# EAGLE design blink1disc_v2a (EAGLE 6.6.0)
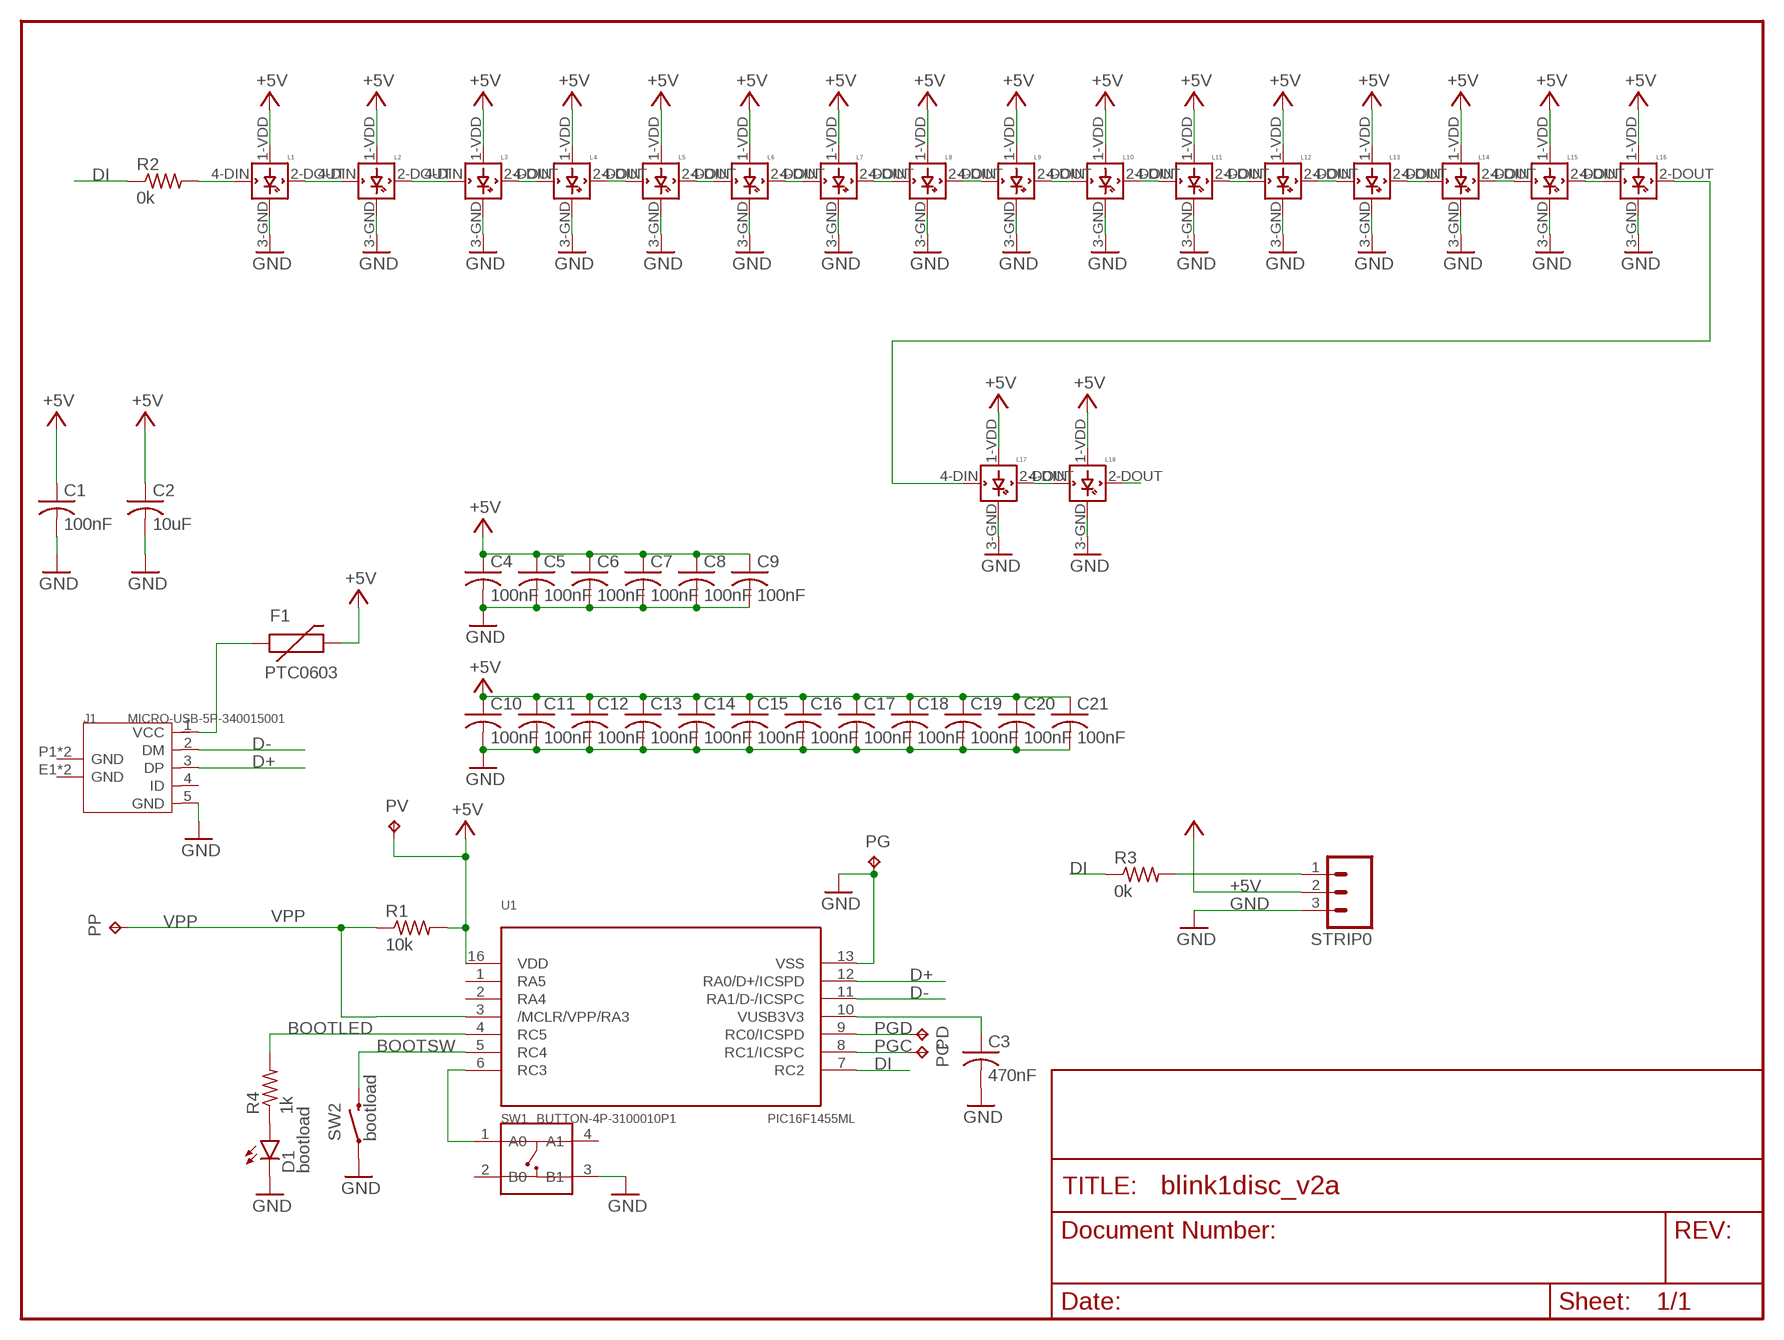
[diagram p0: schematic, sheet 1]

## Parts
C1  100nF  C-USC0603  [C0603]
C2  10uF  C-USC0603  [C0603]
C3  470nF  C-USC0603  [C0603]
C4  100nF  C-USC0603  [C0603]
C5  100nF  C-USC0603  [C0603]
C6  100nF  C-USC0603  [C0603]
C7  100nF  C-USC0603  [C0603]
C8  100nF  C-USC0603  [C0603]
C9  100nF  C-USC0603  [C0603]
C10  100nF  C-USC0603  [C0603]
C11  100nF  C-USC0603  [C0603]
C12  100nF  C-USC0603  [C0603]
C13  100nF  C-USC0603  [C0603]
C14  100nF  C-USC0603  [C0603]
C15  100nF  C-USC0603  [C0603]
C16  100nF  C-USC0603  [C0603]
C17  100nF  C-USC0603  [C0603]
C18  100nF  C-USC0603  [C0603]
C19  100nF  C-USC0603  [C0603]
C20  100nF  C-USC0603  [C0603]
C21  100nF  C-USC0603  [C0603]
D1  bootload  LED-RED0603  [LED-0603]
F1  PTC0603  [0603]
J1  MICRO-USB-5P-340015001  [B-SMD-5P]
L1  WS2812B  [WS2812B]
L2  WS2812B  [WS2812B]
L3  WS2812B  [WS2812B]
L4  WS2812B  [WS2812B]
L5  WS2812B  [WS2812B]
L6  WS2812B  [WS2812B]
L7  WS2812B  [WS2812B]
L8  WS2812B  [WS2812B]
L9  WS2812B  [WS2812B]
L10  WS2812B  [WS2812B]
L11  WS2812B  [WS2812B]
L12  WS2812B  [WS2812B]
L13  WS2812B  [WS2812B]
L14  WS2812B  [WS2812B]
L15  WS2812B  [WS2812B]
L16  WS2812B  [WS2812B]
L17  WS2812B  [WS2812B]
L18  WS2812B  [WS2812B]
PC  TPTP11SQ  [TP11SQ]
PD  TPTP11SQ  [TP11SQ]
PG  TPTP11SQ  [TP11SQ]
PP  TPTP11SQ  [TP11SQ]
PV  TPTP11SQ  [TP11SQ]
R1  10k  R-US_R0603  [R0603]
R2  0k  R-US_R0603  [R0603]
R3  0k  R-US_R0603  [R0603]
R4  1k  R-US_R0603  [R0603]
STRIP0  M03PTH  [1X03]
SW1  BUTTON-4P-3100010P1  [4P-SMD-6.0X6.0X5.0H]
SW2  bootload  SWITCH-MOMENTARY-2TACTILE-SWITCH-SMD-RIGHT-ANGLE  [TACTILE_SWITCH-SMD-RIGHT-ANGLE]
U1  PIC16F1455ML  [QFN16_4X4]

## Nets
+5V: C1.1 C2.1 C4.1 C5.1 C6.1 C7.1 C8.1 C9.1 C10.1 C11.1 C12.1 C13.1 C14.1 C15.1 C16.1 C17.1 C18.1 C19.1 C20.1 C21.1 F1.2 L1.1-VDD(VDD) L2.1-VDD(VDD) L3.1-VDD(VDD) L4.1-VDD(VDD) L5.1-VDD(VDD) L6.1-VDD(VDD) L7.1-VDD(VDD) L8.1-VDD(VDD) L9.1-VDD(VDD) L10.1-VDD(VDD) L11.1-VDD(VDD) L12.1-VDD(VDD) L13.1-VDD(VDD) L14.1-VDD(VDD) L15.1-VDD(VDD) L16.1-VDD(VDD) L17.1-VDD(VDD) L18.1-VDD(VDD) PV.TP R1.2 STRIP0.2 U1.16(VDD)
BOOTLED: R4.2 U1.4(RC5)
BOOTSW: SW2.2 U1.5(RC4)
D+: J1.3(DP) U1.12(RA0/D+/ICSPD)
D-: J1.2(DM) U1.11(RA1/D-/ICSPC)
DI: R2.1 R3.1 U1.7(RC2)
DO1: L2.2-DOUT(DOUT) L3.4-DIN(DIN)
GND: C1.2 C2.2 C3.2 C4.2 C5.2 C6.2 C7.2 C8.2 C9.2 C10.2 C11.2 C12.2 C13.2 C14.2 C15.2 C16.2 C17.2 C18.2 C19.2 C20.2 C21.2 D1.C J1.5(GND) L1.3-GND(GND) L2.3-GND(GND) L3.3-GND(GND) L4.3-GND(GND) L5.3-GND(GND) L6.3-GND(GND) L7.3-GND(GND) L8.3-GND(GND) L9.3-GND(GND) L10.3-GND(GND) L11.3-GND(GND) L12.3-GND(GND) L13.3-GND(GND) L14.3-GND(GND) L15.3-GND(GND) L16.3-GND(GND) L17.3-GND(GND) L18.3-GND(GND) PG.TP STRIP0.3 SW1.3(B1) SW2.1 U1.13(VSS)
N$1: L3.2-DOUT(DOUT) L4.4-DIN(DIN)
N$2: L1.2-DOUT(DOUT) L2.4-DIN(DIN)
N$3: L5.2-DOUT(DOUT) L6.4-DIN(DIN)
N$4: L4.2-DOUT(DOUT) L5.4-DIN(DIN)
N$5: L7.2-DOUT(DOUT) L8.4-DIN(DIN)
N$6: L9.2-DOUT(DOUT) L10.4-DIN(DIN)
N$7: L8.2-DOUT(DOUT) L9.4-DIN(DIN)
N$8: L11.2-DOUT(DOUT) L12.4-DIN(DIN)
N$9: L13.2-DOUT(DOUT) L14.4-DIN(DIN)
N$10: L12.2-DOUT(DOUT) L13.4-DIN(DIN)
N$11: L1.4-DIN(DIN) R2.2
N$12: R3.2 STRIP0.1
N$13: L16.2-DOUT(DOUT) L17.4-DIN(DIN)
N$14: L15.2-DOUT(DOUT) L16.4-DIN(DIN)
N$15: L14.2-DOUT(DOUT) L15.4-DIN(DIN)
N$16: SW1.1(A0) U1.6(RC3)
N$17: L6.2-DOUT(DOUT) L7.4-DIN(DIN)
N$18: L17.2-DOUT(DOUT) L18.4-DIN(DIN)
N$21: D1.A R4.1
N$23: L18.2-DOUT(DOUT)
N$29: L10.2-DOUT(DOUT) L11.4-DIN(DIN)
PGC: PC.TP U1.8(RC1/ICSPC)
PGD: PD.TP U1.9(RC0/ICSPD)
VPP: PP.TP R1.1 U1.3(/MCLR/VPP/RA3)
VUSB: F1.1 J1.1(VCC)
VUSB3V3: C3.1 U1.10(VUSB3V3)
Unconnected: J1.4(ID) J1.E1(GND) J1.E2(GND) J1.P1(GND) J1.P2(GND) SW1.2(B0) SW1.4(A1) U1.1(RA5) U1.2(RA4)

## Library data of the parts
C1-C21 = rcl:C-US: CAPACITOR, American symbol
D1 = SparkFun-LED:LED-RED: Assorted Red LEDs LilyPad 1206- DIO-09912 1206- DIO-00809 0603- DIO-00819; PROD_ID: DIO-00819; VALUE: RED
F1 = SparkFun-PowerIC:PTC: Resettable Fuse PTC Resettable Fuse. Spark Fun Electronics SKU : COM-08357
J1 = OPL Eagle Library:MICRO-USB-5P: ST-USB-001E：MICRO USB B SMD R/A
L1-L18 = adafruit:WS2812B
PC PD PG PP PV = testpad:TP: Test pad
R1-R4 = rcl:R-US_: RESISTOR, American symbol
STRIP0 = SparkFun-Connectors:M03: Header 3 Standard 3-pin 0.1" header. Use with straight break away headers (SKU : PRT-00116), right angle break away headers (PRT-00553), swiss pins (PRT-00743), machine pins (PRT-00117), and female headers (PRT-00115). Molex polarized connector foot print use with SKU : PRT-08232 with associated crimp pins and housings.
SW1 = OPL Eagle Library:BUTTON-4P
SW2 = SparkFun-Electromechanical:SWITCH-MOMENTARY-2: Various NO switches- pushbuttons, reed, etc; PROD_ID: COMP-12265
U1 = todstuffnew:PIC16F1455

## Board
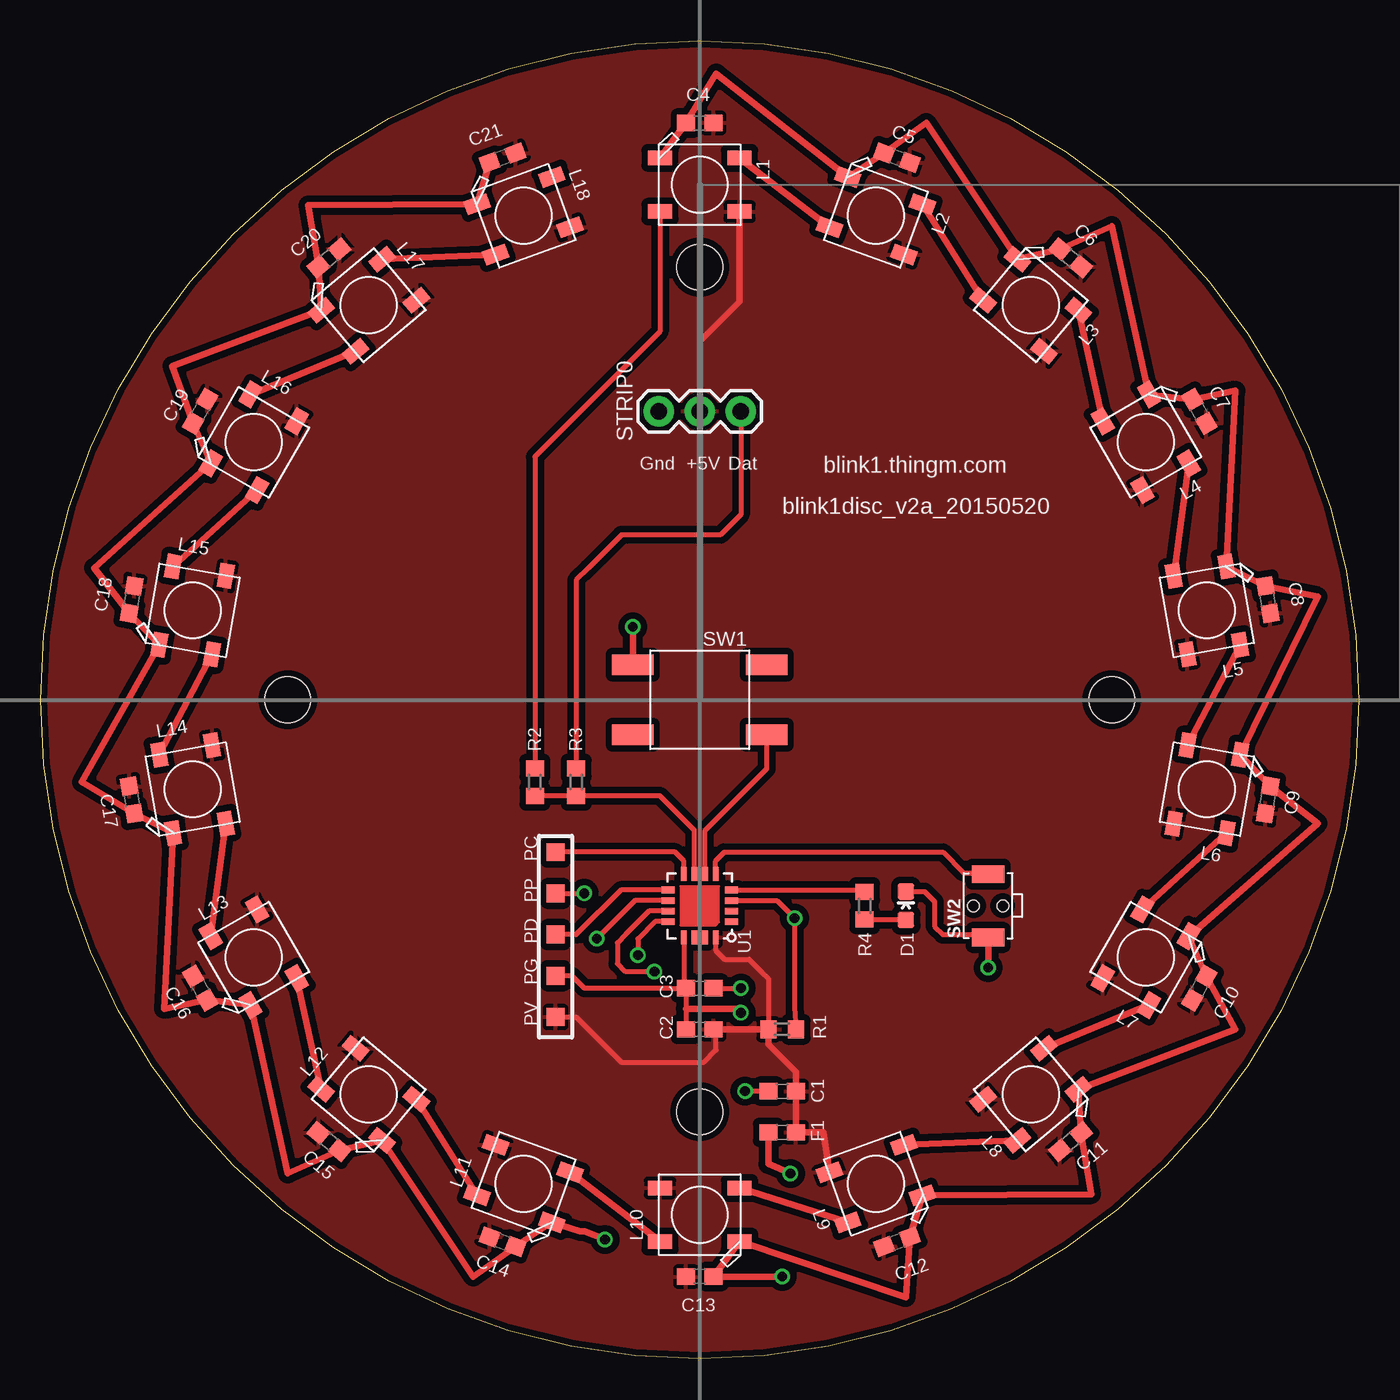
[diagram p1: board, top side]
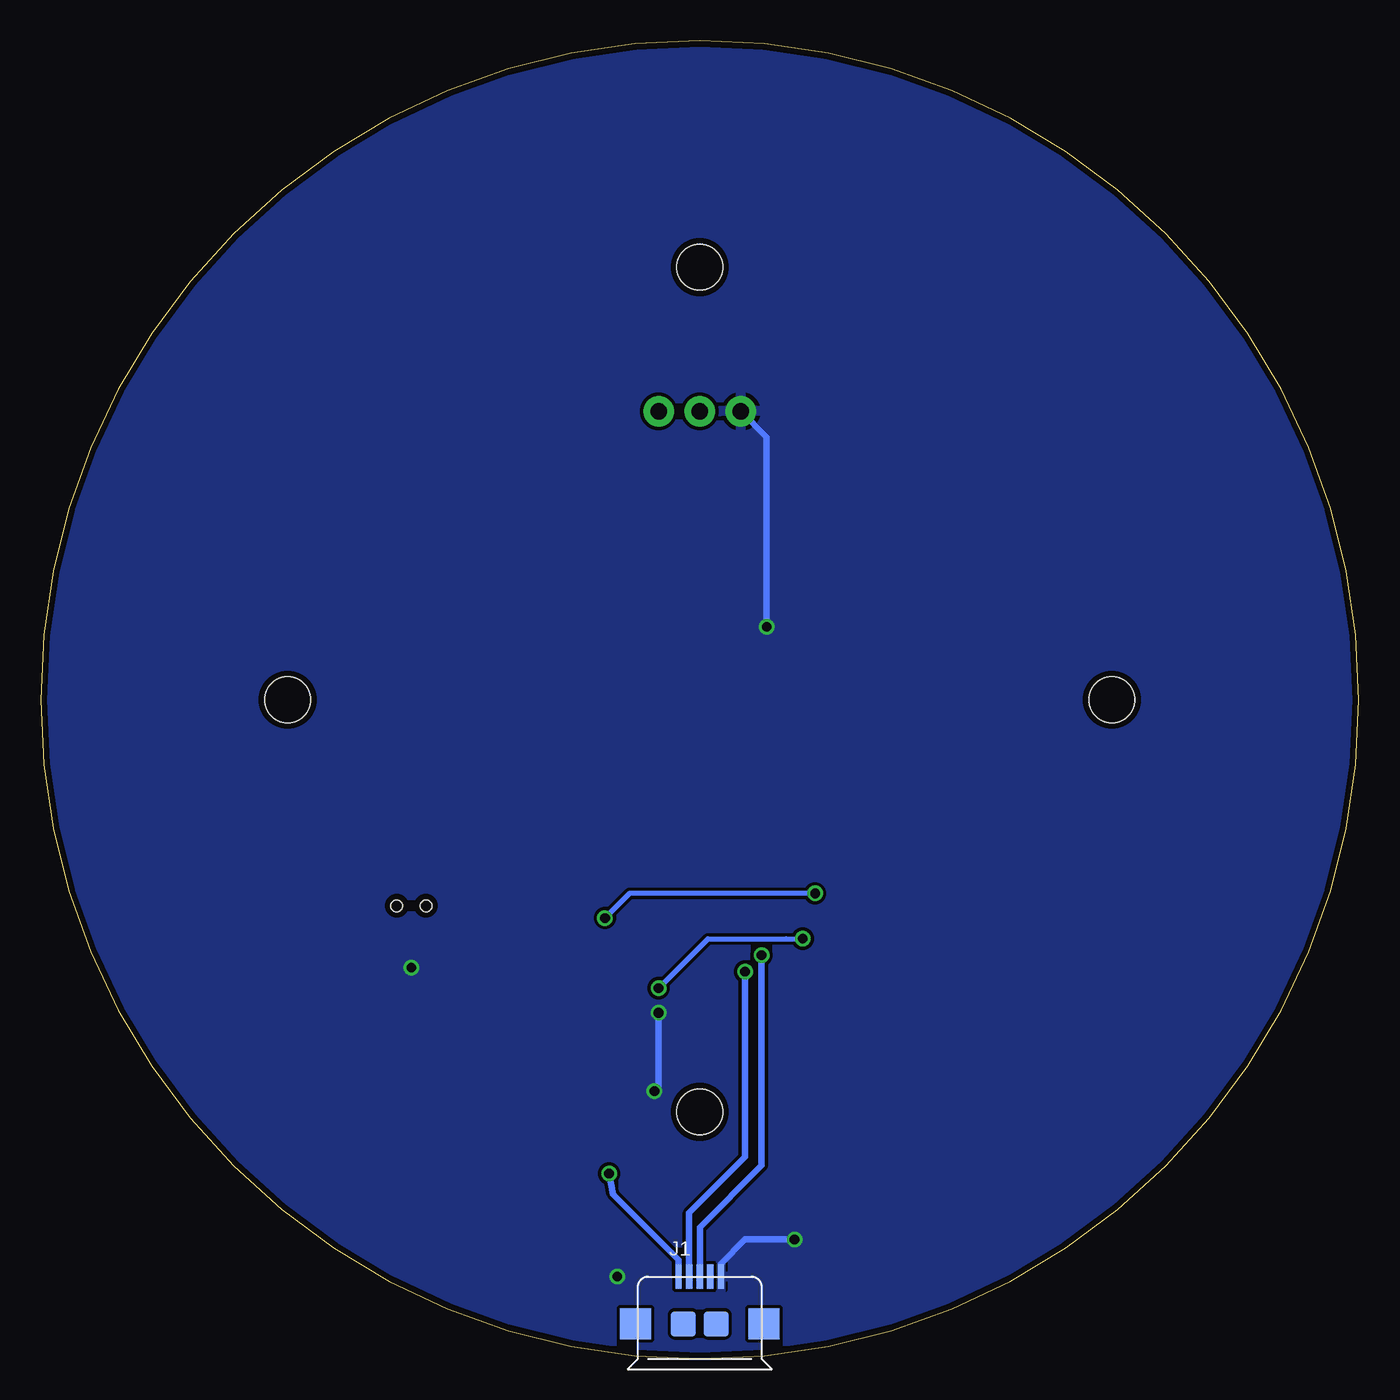
[diagram p2: board, bottom side, seen from below]

Size 81.28 x 81.28 mm. Coordinates in mm from the lower left corner, seen from the top.
Outline: 40.64,81.28 arc-180 40.64,0 arc-180 40.64,81.28
Copper layers (1*16): Top 0.0356mm / dielectric 1.5011mm / Bottom 0.0356mm
Design rules "LaenPCBOrder *": minimum track width 6mil, minimum drill 13mil, track to track 8mil, track to pad 8mil, pad to pad 8mil, via to via 8mil, smd to smd 6mil, copper to edge 15mil, drill to drill 6mil, minimum pad ring 7mil, minimum via ring 7mil, stop-mask expansion 3mil, vias tented up to drill 25mil, thermal gap 10mil
Holes 2.8 mm at 15.24,40.64 66.04,40.64 40.64,15.24 40.64,67.31

### Footprints (pad centres in the part's own frame; a part is rotated, then mirrored left to right if it is on the bottom)
C0603 = smd 1.1 x 1: 1 -0.85,0; 2 0.85,0
LED-0603 = smd 1 x 1: A 0,-0.877; C 0,0.877
0603 = smd 1.1 x 1: 1 -0.85,0; 2 0.85,0
B-SMD-5P = smd 0.38 x 1.52: 1 -1.3,2.54; 2 -0.65,2.54; 3 0,2.54; 4 0.65,2.54; 5 1.3,2.54 | smd 1.524 x 1.524: E1 -1.016,-0.381; E2 1.016,-0.381 | smd 1.9 x 1.9: P1 -3.95,-0.381; P2 3.95,-0.381
WS2812B = smd 1.5 x 0.9: 1-VDD 2.45,-1.65; 2-DOUT 2.45,1.65; 3-GND -2.45,1.65; 4-DIN -2.45,-1.65
TP11SQ = smd 1.1 x 1.1: TP 0,0
R0603 = smd 1 x 1.1: 1 -0.85,0; 2 0.85,0
1X03 = drill 1.016 pad 1.88: 1 0,0; 2 2.54,0; 3 5.08,0
4P-SMD-6.0X6.0X5.0H = smd 2.54 x 1.27: 1 -4.129,2.159; 2 -4.129,-2.159; 3 4.129,-2.159; 4 4.129,2.159
TACTILE_SWITCH-SMD-RIGHT-ANGLE = smd 1.1 x 2: 1 -1.95,0; 2 1.95,0 | hole 0.7: 0,0.9; 0,-0.9
QFN16_4X4 = smd 0.8 x 0.35: 1 -1.95,0.975; 2 -1.95,0.325; 3 -1.95,-0.325; 4 -1.95,-0.975; 9 1.95,-0.975; 10 1.95,-0.325; 11 1.95,0.325; 12 1.95,0.975 | smd 0.35 x 0.8: 5 -0.975,-1.95; 6 -0.325,-1.95; 7 0.325,-1.95; 8 0.975,-1.95; 13 0.975,1.95; 14 0.325,1.95; 15 -0.325,1.95; 16 -0.975,1.95

### Placement (x,y rotation side)
C1  45.72,16.51 180 top
C2  40.64,20.32 180 top
C3  40.64,22.86 180 top
C4  40.64,76.2 180 top
C5  52.8,74.06 160 top
C6  63.5,67.88 140 top
C7  71.44,58.42 120 top
C8  75.66,46.81 100 top
C9  75.66,34.47 80 top
C10  71.44,22.86 60 top
C11  63.5,13.4 40 top
C12  52.8,7.22 20 top
C13  40.64,5.08 0 top
C14  28.48,7.22 340 top
C15  17.78,13.4 320 top
C16  9.84,22.86 300 top
C17  5.62,34.47 280 top
C18  5.62,46.81 260 top
C19  9.84,58.42 240 top
C20  17.78,67.88 220 top
C21  28.48,74.06 200 top
D1  53.34,27.94 0 top
F1  45.72,13.97 0 top
J1  40.64,2.54 0 bottom
L1  40.64,72.39 0 top
L2  51.5,70.48 340 top
L3  61.05,64.96 320 top
L4  68.14,56.52 300 top
L5  71.91,46.15 280 top
L6  71.91,35.13 260 top
L7  68.14,24.77 240 top
L8  61.05,16.32 220 top
L9  51.5,10.8 200 top
L10  40.64,8.89 180 top
L11  29.78,10.8 160 top
L12  20.23,16.32 140 top
L13  13.14,24.77 120 top
L14  9.37,35.13 100 top
L15  9.37,46.15 80 top
L16  13.14,56.52 60 top
L17  20.23,64.96 40 top
L18  29.78,70.48 20 top
PC  31.75,31.24 90 top
PD  31.75,26.16 90 top
PG  31.75,23.62 90 top
PP  31.75,28.7 0 top
PV  31.75,21.08 90 top
R1  45.72,20.32 180 top
R2  30.48,35.56 90 top
R3  33.02,35.56 90 top
R4  50.8,27.94 90 top
STRIP0  43.18,58.42 180 top
SW1  40.64,40.64 180 top
SW2  58.42,27.94 90 top
U1  40.64,27.94 180 top

### Tracks (layer width: path | path; a pad name or v marks a point on that pad's centre or on a via)
+5V
  Top 0.305: U1.16 41.61,25.19 42.16,24.64 43.69,24.64 44.45,23.88 44.87,23.46 R1.2 | PV.TP 33.02,21.08 35.81,18.29 40.89,18.29 41.66,19.05 41.66,20.15 C2.1 | 44.87,19.39 arc90 44.96,19.3
  Top 0.406: 44.96,19.3 46.57,17.69 C1.1 F1.2 48.26,13.97 L9.1-VDD | C2.1 R1.2 44.87,19.39 | STRIP0.2 40.64,62.74 42.93,65.02 43.09,65.19 L1.1-VDD
  pour Top (isolate 0.406): -10.16,85.09 90.17,85.09 90.17,0 -10.16,0
BOOTLED
  Top 0.305: U1.4 50.67,28.91 R4.2
BOOTSW
  Top 0.305: U1.5 41.61,30.69 42.16,31.24 55.63,31.24 56.9,29.97 58.34,29.97 SW2.2
D+  (via drill 0.6)
  Top 0.305: U1.12 37.89,26.96 36.83,25.91 v36.83,24.89
  Bottom 0.406: J1.3 40.64,8.13 36.83,11.94 v36.83,24.89
D-  (via drill 0.6)
  Top 0.305: U1.11 37.52,27.61 36.07,26.16 35.56,25.65 35.56,24.38 36.07,23.88 v37.85,23.88
  Bottom 0.406: J1.2 41.29,9 37.85,12.45 v37.85,23.88
DI
  Top 0.305: U1.7 40.31,31.82 40.31,32.58 39.62,33.27 38.19,34.71 R3.1 R2.1
DO1
  Top 0.406: L2.2-DOUT L3.4-DIN
GND  (via drill 0.6)
  Top 0.305: U1.13 39.66,22.98 C3.2 | C3.2 39.79,21.59 C2.2 | C3.2 38.86,22.86 33.53,22.86 32.77,23.62 PG.TP | D1.C 54.5,28.82 55.12,28.19 55.12,26.67 55.63,26.16 58.25,26.16 SW2.1 | C1.2 v43.43,16.51
  Top 0.406: v34.8,7.37 33.53,7.87 33.27,7.87 L11.3-GND 29.84,7.31 | v43.18,21.34 42.93,21.59 39.79,21.59 | L1.3-GND C4.2 41.66,79.25 L2.3-GND C5.2 54.61,76.2 L3.3-GND C6.2 66.04,69.85 L4.3-GND C7.2 73.66,59.69 L5.3-GND C8.2 78.74,46.99 L6.3-GND C9.2 78.74,33.02 L7.3-GND C10.2 73.66,20.32 L8.3-GND C11.2 64.77,10.16 L9.3-GND C12.2 53.34,3.81 L10.3-GND C13.2 v45.72,5.08 | C21.2 L18.3-GND 16.51,71.12 C20.2 L17.3-GND 8.13,61.21 C19.2 L16.3-GND 3.3,48.77 C18.2 L15.3-GND 2.54,35.56 C17.2 L14.3-GND 7.62,21.59 C16.2 L13.3-GND 15.24,11.43 C15.2 L12.3-GND 26.67,5.08 29.84,7.31 | 29.84,7.31 C14.2 | SW1.3 v36.51,45.15 | SW2.1 v58.42,24.13
  Bottom 0.406: J1.5 39.34,5.87 37.85,7.37 v34.8,7.37 | v43.43,16.51 43.18,16.76 v43.18,21.34 | v36.51,45.15 36.51,56.83 STRIP0.3
  pour Bottom: 0,95.25 99.06,95.25 97.79,-2.54 -1.27,-2.54
N$1
  Top 0.406: L3.2-DOUT L4.4-DIN
N$2
  Top 0.406: L1.2-DOUT L2.4-DIN
N$3
  Top 0.406: L5.2-DOUT L6.4-DIN
N$4
  Top 0.406: L4.2-DOUT L5.4-DIN
N$5
  Top 0.406: L7.2-DOUT L8.4-DIN
N$6
  Top 0.406: L9.2-DOUT L10.4-DIN
N$7
  Top 0.406: L8.2-DOUT L9.4-DIN
N$8
  Top 0.406: L11.2-DOUT L12.4-DIN
N$9
  Top 0.406: L13.2-DOUT L14.4-DIN
N$10
  Top 0.406: L12.2-DOUT L13.4-DIN
N$11
  Top 0.305: 35.05,60.2 30.48,55.63 R2.2 | 35.05,60.2 35.31,60.45 | L1.4-DIN 38.19,63.34 35.05,60.2
N$12
  Top 0.305: STRIP0.1 43.18,52.07 41.91,50.8 35.81,50.8 33.78,48.77 33.02,48.01 R3.2
N$13
  Top 0.406: L16.2-DOUT L17.4-DIN
N$14
  Top 0.406: L15.2-DOUT L16.4-DIN
N$15
  Top 0.406: L14.2-DOUT L15.4-DIN
N$16
  Top 0.305: U1.6 40.97,32.58 43.69,35.31 44.77,36.39 SW1.1
N$17
  Top 0.406: L6.2-DOUT L7.4-DIN
N$18
  Top 0.406: L17.2-DOUT L18.4-DIN
N$21
  Top 0.305: R4.1 53.31,27.09 D1.A
N$29
  Top 0.406: L10.2-DOUT L11.4-DIN
PGC
  Top 0.305: U1.8 39.66,30.69 39.12,31.24 PC.TP
PGD
  Top 0.305: U1.9 35.77,28.91 33.02,26.16 PD.TP
VPP  (via drill 0.6)
  Top 0.305: U1.3 45.39,28.27 46.1,27.56 | 46.1,27.56 v46.48,27.18 | v46.48,27.18 46.48,21.68 R1.1 | PP.TP v33.53,28.7 | v46.48,27.18 46.1,27.56
  Bottom 0.305: v33.53,28.7 44.96,28.7 v46.48,27.18
VUSB  (via drill 0.6)
  Top 0.406: F1.1 44.87,12.03 v46.23,11.43
  Bottom 0.406: J1.1 41.94,5.87 41.94,6.13 45.97,10.16 v46.23,11.43
VUSB3V3  (via drill 0.6)
  Top 0.305: U1.10 36.65,28.27 34.8,26.42 v34.29,25.91 | C3.1 v43.18,22.86
  Bottom 0.305: v43.18,22.86 40.13,25.91 35.31,25.91 v34.29,25.91

### Text on the board
tNames: Gnd | +5V | Dat | blink1.thingm.com | blink1disc_v2a_20150520